# EAGLE design DS3231 (EAGLE 7.7.0)
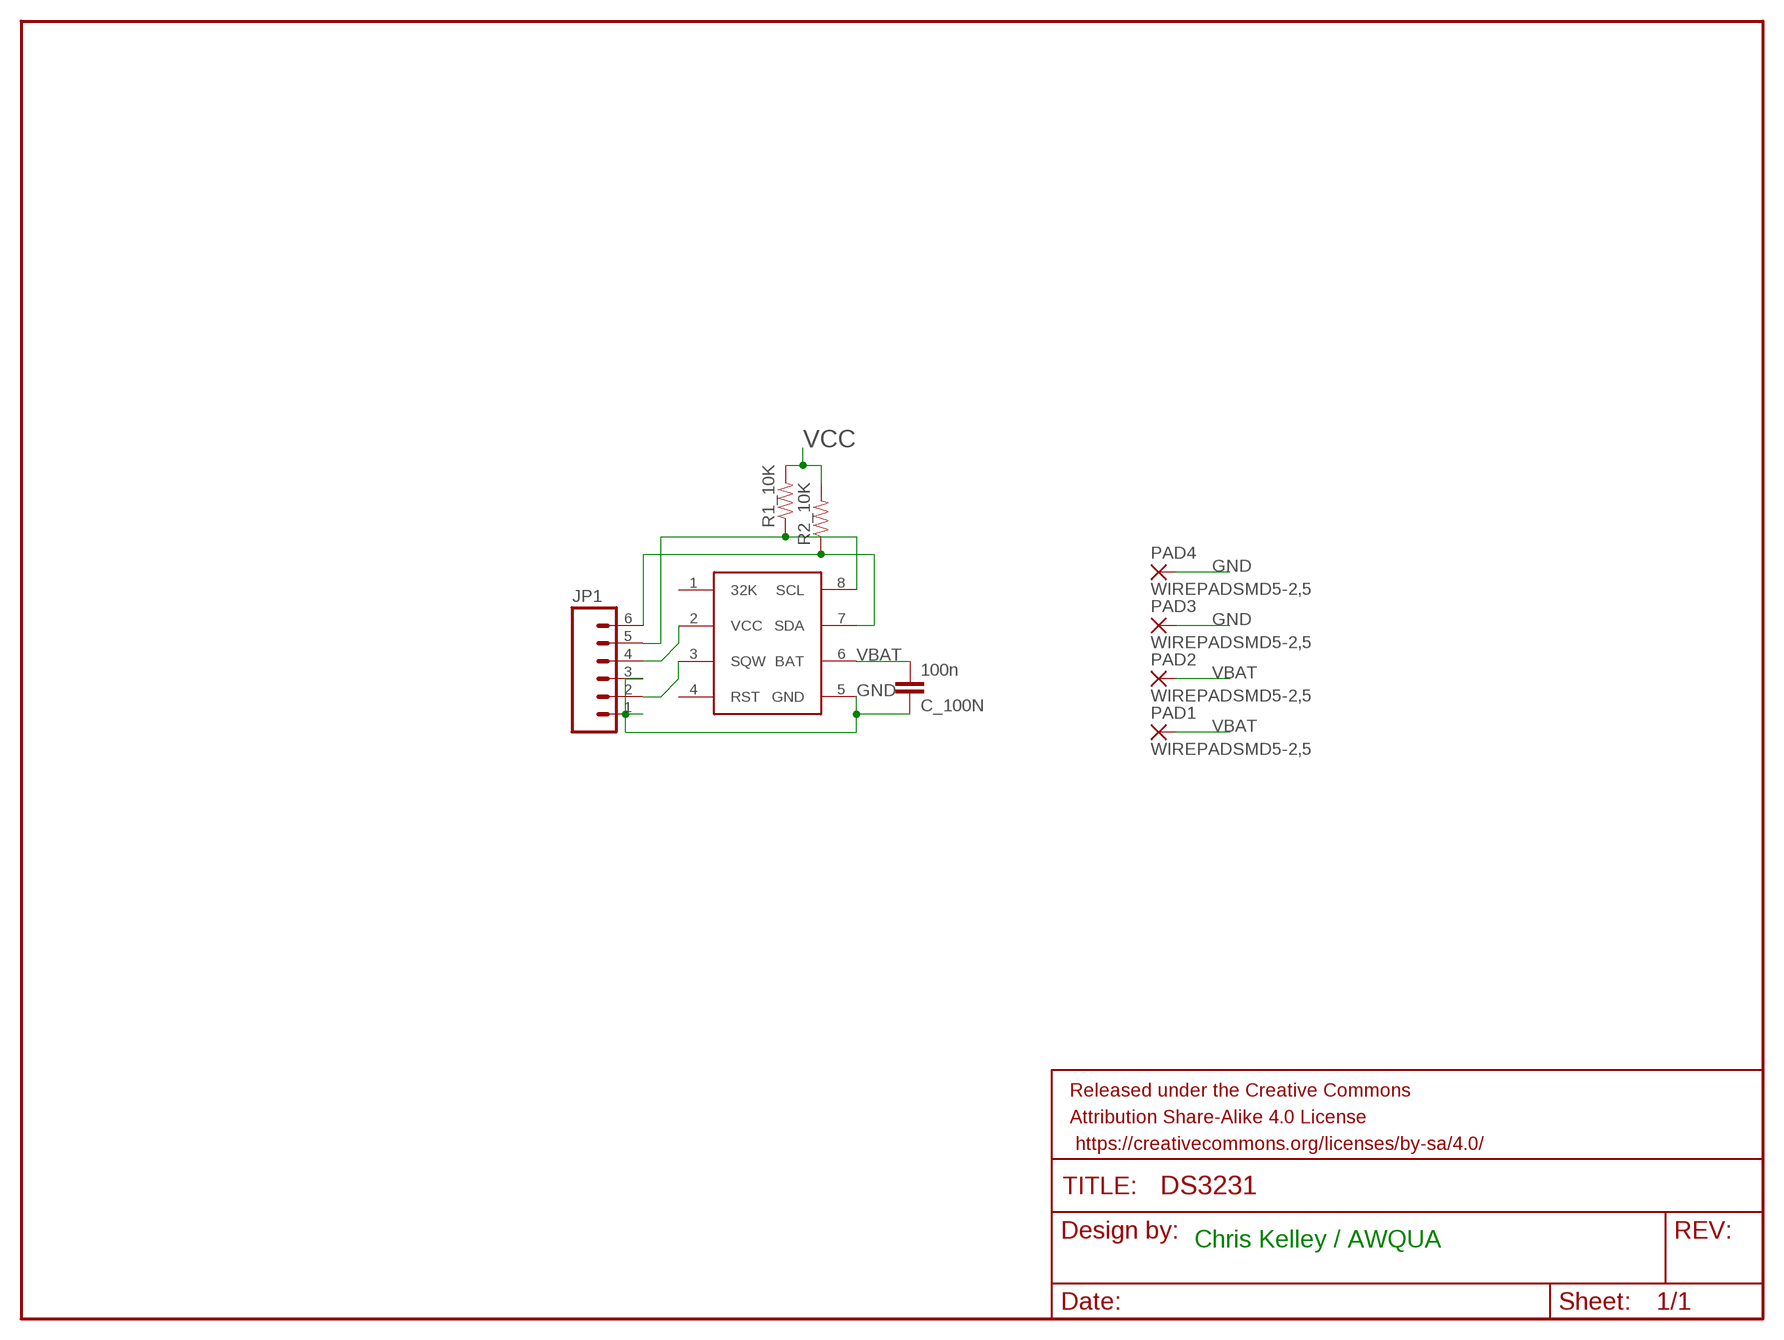
[diagram p0: schematic, sheet 1]

## Parts
C_100N  100n  CAP0603-CAP  [0603-CAP]
DS3231  DS3231M  [DS3231M]
FRAME1  FRAME-LETTER  [CREATIVE_COMMONS]
JP1  M06SILK_FEMALE_PTH  [1X06]
PAD1  WIREPADSMD5-2,5  [5-2,5]
PAD2  WIREPADSMD5-2,5  [5-2,5]
PAD3  WIREPADSMD5-2,5  [5-2,5]
PAD4  WIREPADSMD5-2,5  [5-2,5]
R1_10K  RESISTOR0603-RES  [0603-RES]
R2_10K  RESISTOR0603-RES  [0603-RES]

## Nets
GND: C_100N.1 DS3231.5(GND) JP1.1 JP1.3 PAD3.1(P) PAD4.1(P)
SCL: DS3231.8(SCL) JP1.5 R1_10K.1
SDA: DS3231.7(SDA) JP1.6 R2_10K.1
SQW: DS3231.3(SQW) JP1.2
VBAT: C_100N.2 DS3231.6(BAT) PAD1.1(P) PAD2.1(P)
VCC: DS3231.2(VCC) JP1.4 R1_10K.2 R2_10K.2
Unconnected: DS3231.1(32K) DS3231.4(RST)

## Notes on the sheet
- Chris Kelley / AWQUA

## Library data of the parts
C_100N = SparkFun:CAP: Capacitor Standard 0603 ceramic capacitor, and 0.1" leaded capacitor.
DS3231 = open_source_turbidimeter:DS3231M
FRAME1 = SparkFun-Aesthetics:FRAME-LETTER: Schematic Frame Standard 8.5x11 US Letter frame
JP1 = SparkFun-Connectors:M06: Header 6 Standard 6-pin 0.1" header. Use with straight break away headers (SKU : PRT-00116), right angle break away headers (PRT-00553), swiss pins (PRT-00743), machine pins (PRT-00117), and female headers (PRT-00115). Molex polarized connector foot print use with SKU : PRT-08094 with associated crimp pins and housings. NOTES ON THE VARIANTS LOCK and LOCK_LONGPADS... This footprint was designed to help hold the alignment of a through-hole component (i.e. 6-pin header) while soldering it into place. You may notice that each hole has been shifted either up or down by 0.005 of an inch from it's more standard position (which is a perfectly straight line). This slight alteration caused the pins (the squares in the middle) to touch the edges of the holes. Because they are alternating, it causes a "brace" to hold the component in place. 0.005 has proven to be the perfect amount of "off-center" position when using our standard breakaway headers. Although looks a little odd when you look at the bare footprint, once you have a header in there, the alteration is very hard to notice. Also,if you push a header all the way into place, it is covered up entirely on the bottom side. This idea of altering the position of holes to aid alignment will be further integrated into the Sparkfun Library for other footprints. It can help hold any component with 3 or more connection pins.; PROD_ID: CONN-08437
PAD1-PAD4 = wirepad:WIREPAD: Wire PAD connect wire on PCB
R1_10K R2_10K = SparkFun-Passives:RESISTOR: Resistor Basic schematic elements and footprints for 0603, 1206, and PTH resistors.

## Board
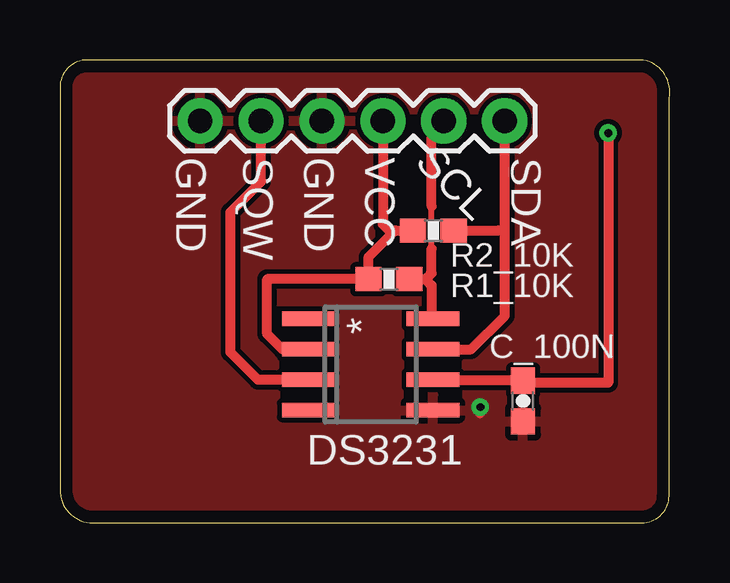
[diagram p1: board, top side]
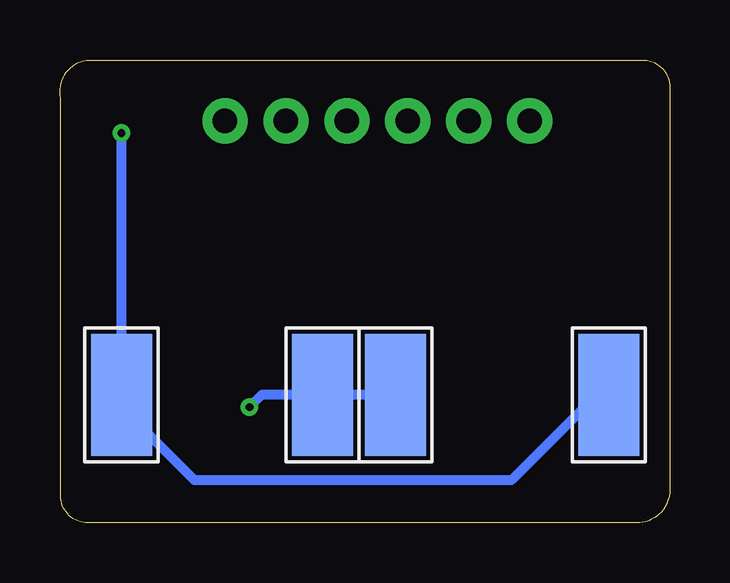
[diagram p2: board, bottom side, seen from below]

Size 25.42 x 19.3 mm. Coordinates in mm from the lower left corner, seen from the top.
Outline: 0,18.17 0,1.37 arc90 1.37,0 24.26,0 arc90 25.4,1.14 25.4,17.72 arc90 24.32,19.3 1.14,19.3 arc90 0,18.17
Copper layers (1*16): Top 0.035mm / dielectric 1.5mm / Bottom 0.035mm
Design rules "default *": minimum track width 10mil, minimum drill 24mil, track to track 8mil, track to pad 8mil, pad to pad 8mil, via to via 8mil, smd to smd 8mil, copper to edge 20mil, drill to drill 8mil, minimum pad ring 10mil, minimum via ring 8mil, stop-mask expansion 4mil, vias tented up to drill 13mil, thermal gap 10mil

### Footprints (pad centres in the part's own frame; a part is rotated, then mirrored left to right if it is on the bottom)
0603-CAP = smd 1.1 x 1: 1 -0.85,0; 2 0.85,0
DS3231M = smd 2.2 x 0.6: 1 -2.6,1.905; 2 -2.6,0.635; 3 -2.6,-0.635; 4 -2.6,-1.905; 5 2.6,-1.905; 6 2.6,-0.635; 7 2.6,0.635; 8 2.6,1.905
1X06 = drill 1.016 pad 1.88: 1 0,0; 2 2.54,0; 3 5.08,0; 4 7.62,0; 5 10.16,0; 6 12.7,0
5-2,5 = smd 2.54 x 5.08: 1 0,0
0603-RES = smd 1.1 x 1: 1 -0.85,0; 2 0.85,0

### Placement (x,y rotation side)
C_100N  19.3,5.08 90 top
DS3231  12.95,6.6 0 top
FRAME1  -12.19,-10.16 0 top  (outside the outline)
JP1  5.84,16.76 0 top
PAD1  22.86,5.33 0 bottom
PAD2  2.54,5.33 0 bottom
PAD3  14.48,5.33 0 bottom
PAD4  11.43,5.33 180 bottom
R1_10K  13.72,10.16 180 top
R2_10K  15.57,12.19 180 top

### Tracks (layer width: path | path; a pad name or v marks a point on that pad's centre or on a via)
GND  (via drill 0.33)
  Top 0.406: v17.53,4.83 17.53,4.57
  Bottom 0.406: v17.53,4.83 17.02,5.33 PAD3.1 PAD4.1
  pour Top: -2.54,21.08 27.94,21.08 27.94,-1.78 -2.54,-1.78
SCL
  Top 0.254: 15.49,11.43 15.49,13.21 | 15.49,16.06 15.55,16.06
  Top 0.406: 15.49,13.21 15.49,16.06 | 15.55,16.06 JP1.5 | R1_10K.1 15.3,10.16 | 15.3,10.16 15.3,10.22 15.49,10.41 15.49,11.43 | 15.3,10.16 15.3,10.1 15.49,9.91 15.49,8.57 DS3231.8
SDA
  Top 0.254: 18.29,12.19 18.54,12.45
  Top 0.406: DS3231.7 17.14,7.24 18.54,8.64 18.54,12.45 JP1.6 | R2_10K.1 18.29,12.19
SQW
  Top 0.406: DS3231.3 8.26,5.97 7.11,7.11 7.11,12.95 8.38,14.22 JP1.2
VBAT  (via drill 0.33)
  Top 0.406: v22.86,16.26 22.86,5.84 19.39,5.84 C_100N.2 15.59,5.93 DS3231.6
  Bottom 0.406: v22.86,16.26 PAD1.1 22.61,5.08 22.61,4.57 19.81,1.78 6.6,1.78 3.05,5.33 PAD2.1
VCC
  Top 0.406: DS3231.2 9.27,7.24 8.64,7.87 8.64,10.16 R1_10K.2 12.87,11.09 13.84,12.06 | 13.84,12.06 13.97,12.19 R2_10K.2 | JP1.4 13.46,12.45 13.84,12.06

### Text on the board
tPlace: Chris Kelley / AWQUA
tNames: GND | SQW | GND | VCC | SCL | SDA | *